# Altium project Buzzer_Module.PrjPcb
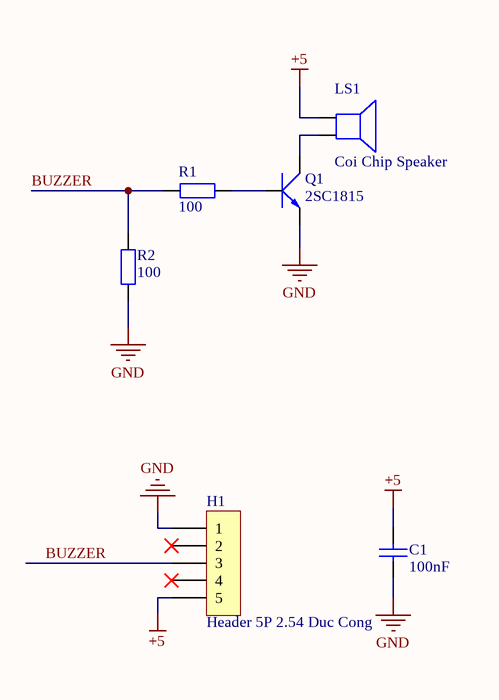
[diagram p0: Buzzer_SCH.SchDoc]
1 sheet, 6 parts. Net scope: global (net labels, ports and power ports of the same name join across sheets).
Board file: Buzzer_PCB.PcbDoc

## Sheet Buzzer_SCH.SchDoc
size A4; SheetNumber: 1; SheetTotal: 1

### Parts
C1  100nF  [tu 0603]
H1  Header 5P 2.54 Duc Cong  [Header 5P DC 2.54]
LS1  Coi Chip Speaker  [Coi Chip Speacker]
Q1  2SC1815  [SOT-23]
R1  100  [tro smd 0603]
R2  100  [tro smd 0603]

### Nets
+5: C1.1 H1.5 LS1.1
GND: C1.2 H1.1 Q1.2(E) R2.1
BUZZER: H1.3 R1.1 R2.2
NetLS1_2: LS1.2 Q1.3(C)
NetQ1_1: Q1.1(B) R1.2

Not connected (* = marked no-connect by the designer): H1 2* 4*

### Library data of the parts
C1 = Tu 0603 104 50V 10%: Dán; Don_Vi: Con; So_Chan: 2; Ten_Linh_Kien: Tụ 0603 104-100nF 10% 50V; Ma_Hang: MH004568; Chung_Loai: Dán; Kieu_Chan: *
H1 = Header 5P 2.54 Duc Cong: Cắm; Ten_Linh_Kien: Header 5P XH2.54-5P Đực Cong; Don_Vi: Con; Ma_Hang: MH001308; Chung_Loai: Cắm
LS1 = Coi Chip Speaker: Còi chip
Q1 = Trans C1815 HF SMD: SOT-23; Value: C9014
R1 R2 = Tro 0603 5% 100R: Dán; Don_Vi: Con; So_Chan: 2; Ten_Linh_Kien: Trở 0603 5% 100R; Ma_Hang: MH006315; Chung_Loai: Dán; Kieu_Chan: *